# EAGLE design weather_shield (EAGLE 6.4)
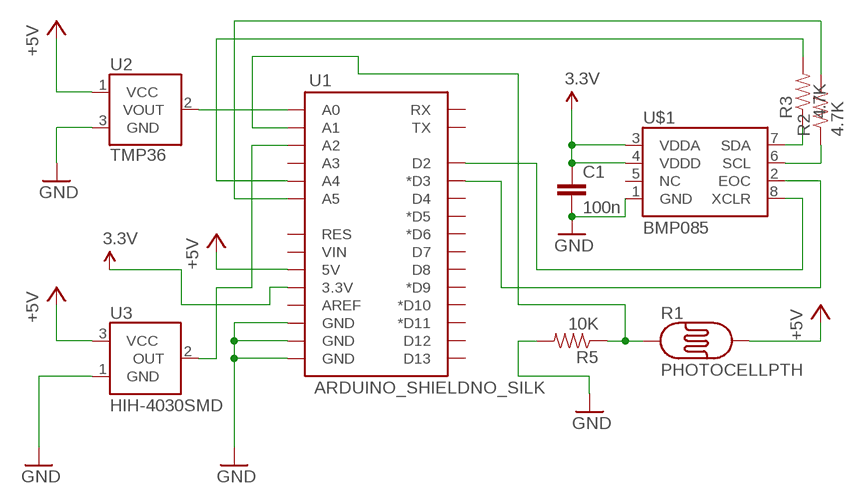
[diagram p0: schematic, sheet 1]

## Parts
C1  100n  CAP1206  [1206]
R1  PHOTOCELLPTH  [PHOTOCELL]
R2  4.7K  RESISTOR1206  [1206]
R3  4.7K  RESISTOR1206  [1206]
R5  10K  RESISTOR1206  [1206]
U1  ARDUINO_SHIELDNO_SILK  [DUEMILANOVE_VIAS]
U2  TMP36  TMP36GT9  [TO-92]
U3  HIH-4030SMD  [HIH-4030]
U$1  BMP085  [BMP085]

## Nets
3.3V: C1.1 U1.3.3V U$1.3(VDDA) U$1.4(VDDD)
+5V: R1.2 U1.5V U2.1(VCC) U3.3(VCC)
GND: C1.2 R5.2 U1.GND@0(GND) U1.GND@1(GND) U1.GND@2(GND) U2.3(GND) U3.1(GND) U$1.1(GND)
N$1: R1.1 R5.1 U1.A1
N$2: U1.A2 U3.2(OUT)
N$3: U1.A0 U2.2(VOUT)
N$4: R3.1 U$1.7(SDA)
N$5: R2.1 U$1.6(SCL)
N$6: U1.D2 U$1.8(XCLR)
N$7: R3.2 U1.A4
N$8: R2.2 U1.A5
N$9: U1.D3(*D3) U$1.2(EOC)
Unconnected: U1.A3 U1.AREF U1.D4 U1.D5(*D5) U1.D6(*D6) U1.D7 U1.D8 U1.D9(*D9) U1.D10(*D10) U1.D11(*D11) U1.D12 U1.D13 U1.RES U1.RX U1.TX U1.VIN U$1.5(NC)

## Library data of the parts
C1 = SparkFun-Passives:CAP: Capacitor Standard 0603 ceramic capacitor, and 0.1" leaded capacitor.
R1 = SparkFun-Sensors:PHOTOCELL: CdS photoresistor. This is a low cost way to detect light levels. Resistance decreases with more incoming light. SparkFun SKU: SEN-09088
R2 R3 R5 = SparkFun-Passives:RESISTOR: Resistor Basic schematic elements and footprints for 0603, 1206, and PTH resistors.
U1 = SparkFun-Boards:ARDUINO_SHIELD: Arduino shield footprint
U2 = SparkFun-Sensors:TMP36: Precision degC temp sensor, analog out
U3 = SparkFun-Sensors:HIH-4030: Humidity Sensor
U$1 = SparkFun-Sensors:BMP085: BMP085 Pressure Sensor Great little MEMS pressure sensor. SKU: COM-09603

## Net classes
0 default: width 0.508 mm

## Board
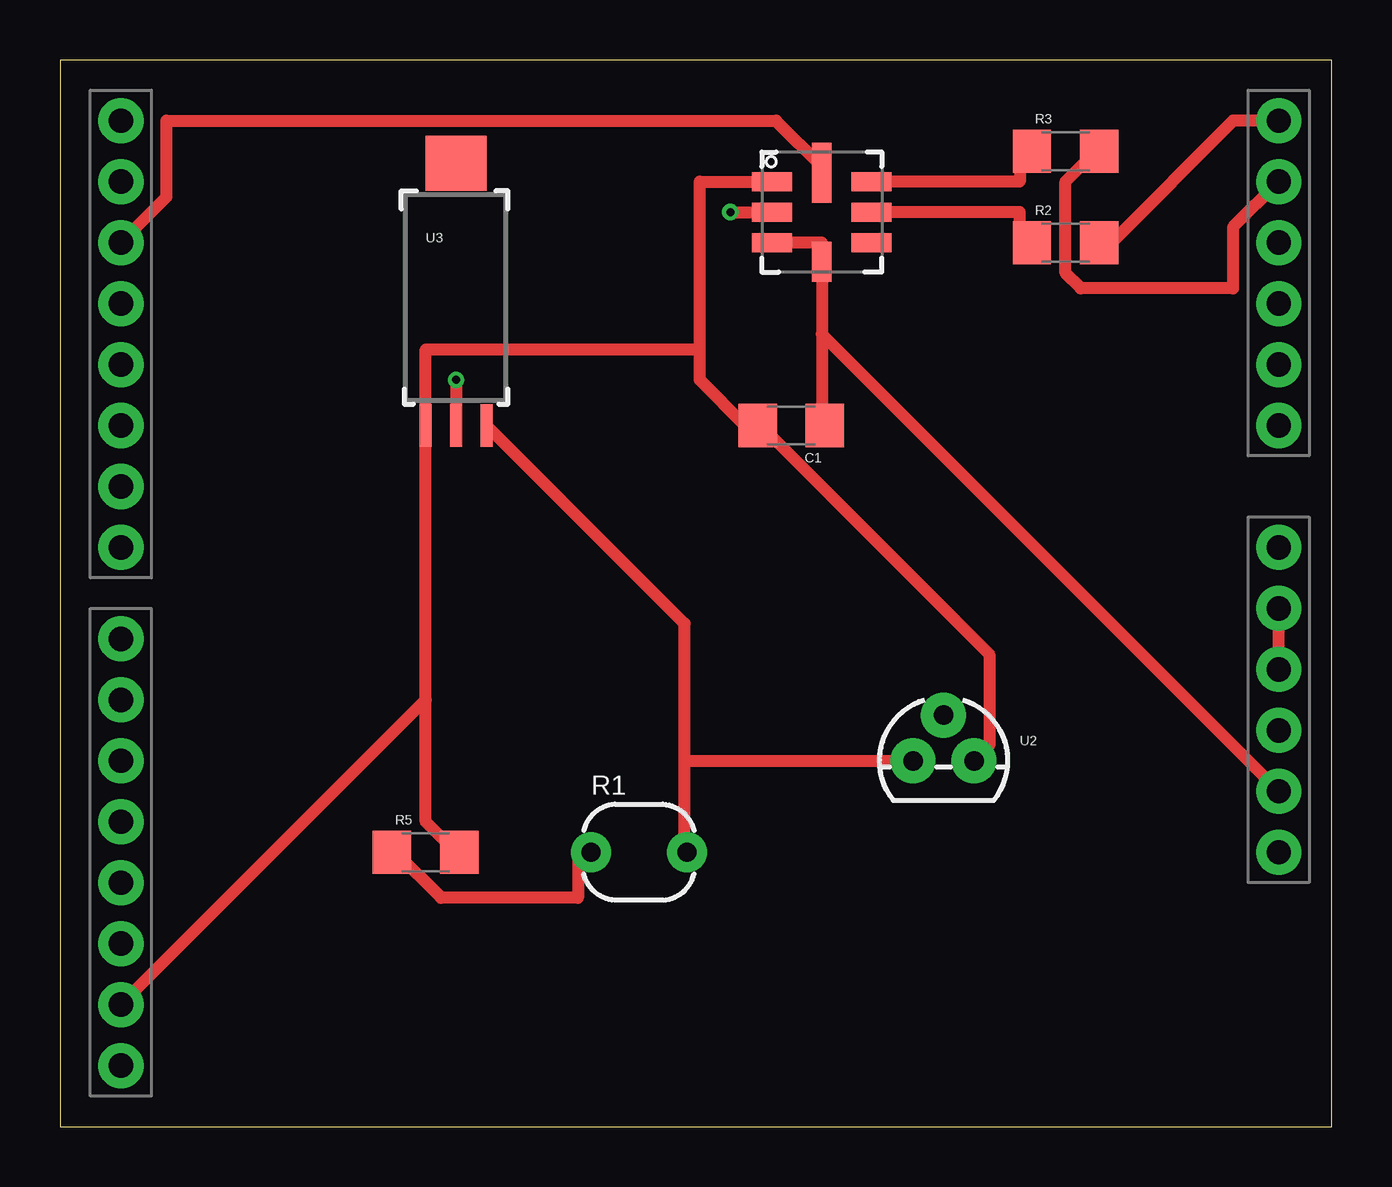
[diagram p1: board, top side]
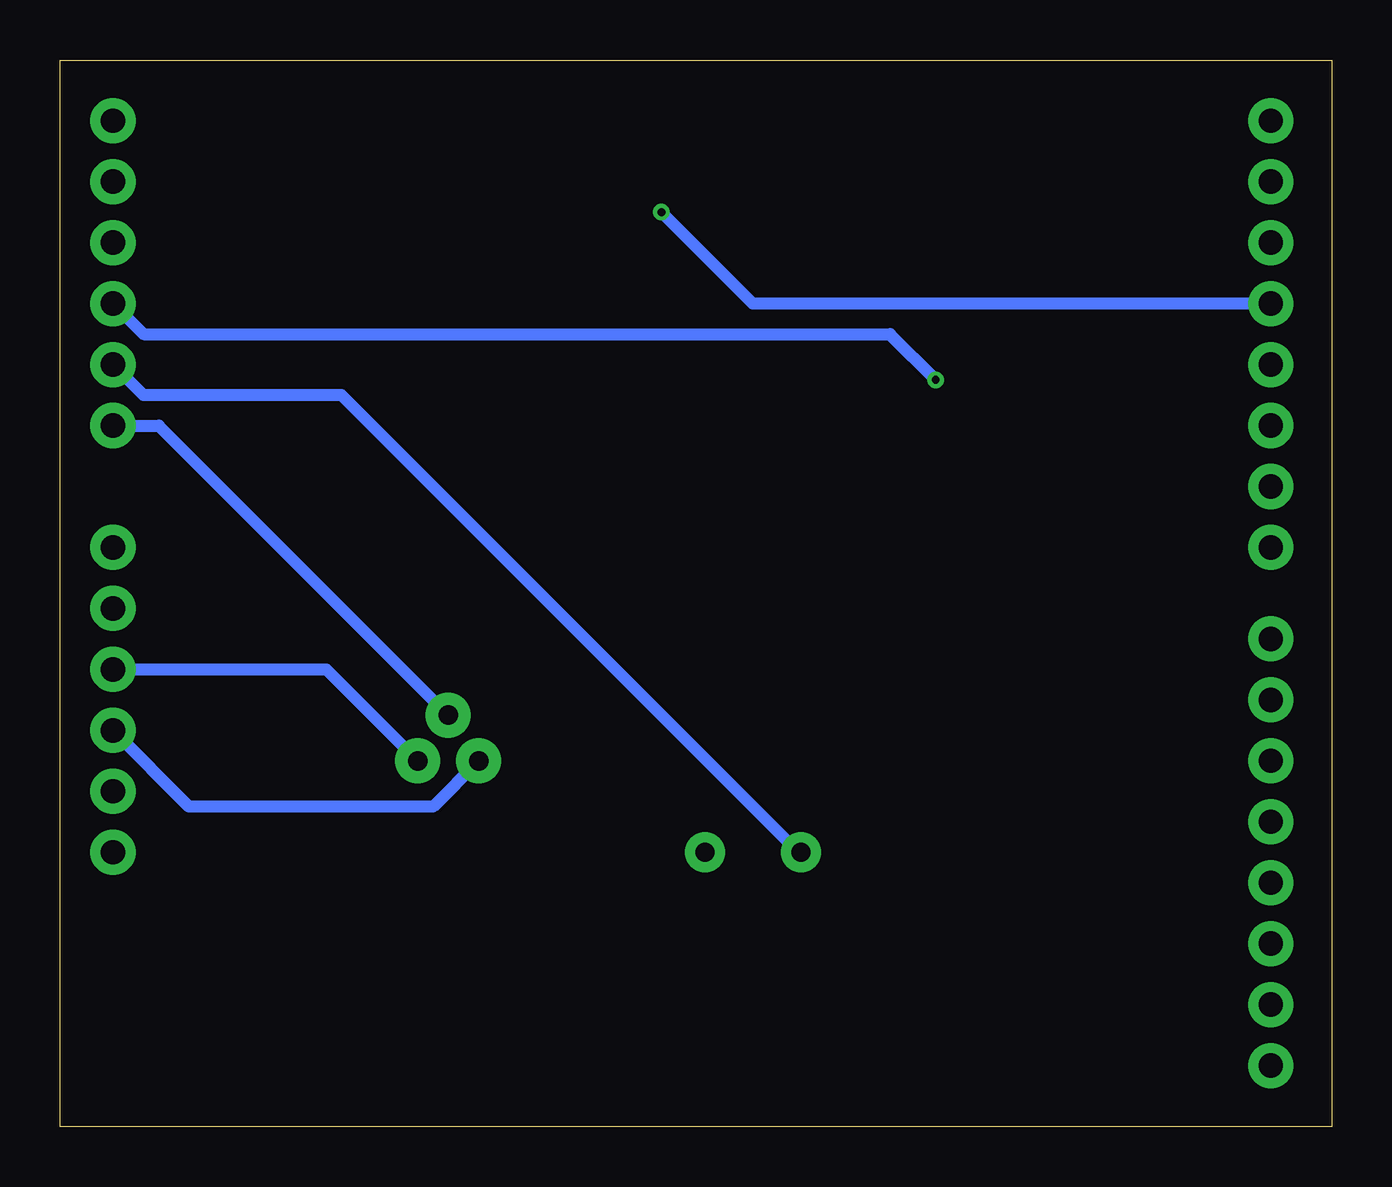
[diagram p2: board, bottom side, seen from below]

Size 53.01 x 44.44 mm. Coordinates in mm from the lower left corner, seen from the top.
Outline: 0,0 53.01,0 53.01,44.44 0,44.44 0,0
Copper layers (1*16): Top 0.0356mm / dielectric 1.5011mm / Bottom 0.0356mm
Design rules "LaenPCBOrder": minimum track width 6mil, minimum drill 13mil, track to track 6mil, track to pad 6mil, pad to pad 6mil, via to via 6mil, smd to smd 6mil, copper to edge 15mil, drill to drill 6mil, minimum pad ring 7mil, minimum via ring 7mil, stop-mask expansion 4mil, vias tented up to drill 0mil, thermal gap 10mil

### Footprints (pad centres in the part's own frame; a part is rotated, then mirrored left to right if it is on the bottom)
1206 = smd 1.6 x 1.8: 1 -1.4,0; 2 1.4,0
PHOTOCELL = drill 0.8 pad 1.676: 1 -2,0; 2 2,0
DUEMILANOVE_VIAS = drill 1.016 pad 1.88: 3.3V 50.8,13.97; 5V 50.8,16.51; A0 50.8,29.21; A1 50.8,31.75; A2 50.8,34.29; A3 50.8,36.83; A4 50.8,39.37; A5 50.8,41.91; AREF 2.54,2.54; D2 2.54,36.83; D3 2.54,34.29; D4 2.54,31.75; D5 2.54,29.21; D6 2.54,26.67; D7 2.54,24.13; D8 2.54,20.32; D9 2.54,17.78; D10 2.54,15.24; D11 2.54,12.7; D12 2.54,10.16; D13 2.54,7.62; GND@0 50.8,19.05; GND@1 50.8,21.59; GND@2 2.54,5.08; RES 50.8,11.43; RX 2.54,41.91; TX 2.54,39.37; VIN 50.8,24.13
TO-92 = drill 0.813 pad 1.88: 1 -1.27,0; 2 0,1.905; 3 1.27,0
HIH-4030 = smd 0.508 x 1.778: 1 -1.27,-5.08; 2 0,-5.08; 3 1.27,-5.08 | smd 2.54 x 2.286: NC 0,5.842
BMP085 = smd 1.67 x 0.8: 1 -2.065,1.27; 2 -2.065,0; 3 -2.065,-1.27; 5 2.065,-1.27; 6 2.065,0; 7 2.065,1.27 | smd 0.8 x 1.67: 4 0,-2.065 | smd 0.8 x 2.5: 8 0,1.65

### Placement (x,y rotation side)
C1  30.48,29.21 180 top
R1  24.13,11.43 0 top
R2  41.91,36.83 0 top
R3  41.91,40.64 0 top
R5  15.24,11.43 0 top
U1  0,0 0 top
U2  36.83,15.24 0 top
U3  16.51,34.29 0 top
U$1  31.75,38.1 0 top

### Tracks (layer width: path | path; a pad name or v marks a point on that pad's centre or on a via)
3.3V
  Top 0.508: U$1.3 31.75,36.83 U$1.4 31.75,33.02 | 31.75,33.02 31.75,29.21 C1.1 | 31.75,33.02 U1.3.3V
+5V
  Top 0.508: U3.3 26.04,20.95 26.04,15.24 | 26.04,15.24 26.04,11.43 R1.2 | 26.04,15.24 U2.1
  Bottom 0.508: U1.5V 47.62,13.33 37.47,13.33 U2.1
GND
  Top 0.508: U1.GND@0 U1.GND@1 | 29.84,39.37 U$1.1 26.67,39.37 26.67,32.38 | 26.67,32.38 26.67,31.12 28.57,29.21 C1.2 29.21,29.21 38.73,19.68 38.73,15.88 U2.3 | 15.24,17.78 15.24,12.7 16.51,11.43 R5.2 | 15.24,17.78 U3.1 15.24,32.38 26.67,32.38 | 15.24,17.78 U1.GND@2
  Bottom 0.508: U2.3 41.91,19.05 U1.GND@0
N$1
  Top 0.508: R5.1 13.97,11.43 15.88,9.52 21.59,9.52 21.59,11.43 R1.1
  Bottom 0.508: U1.A1 49.53,30.48 41.27,30.48 22.23,11.43 R1.1
N$2  (via drill 0.33)
  Top 0.508: v16.51,31.12 U3.2
  Bottom 0.508: v16.51,31.12 18.41,33.02 49.53,33.02 U1.A2
N$3
  Bottom 0.508: U2.2 48.9,29.21 U1.A0
N$4
  Top 0.508: U$1.7 40.01,39.37 40.01,40.64 R3.1
N$5
  Top 0.508: U$1.6 40.01,38.1 40.01,36.83 R2.1
N$6
  Top 0.508: U1.D2 4.45,38.73 4.45,41.91 29.84,41.91 31.75,40.01 U$1.8
N$7
  Top 0.508: U1.A4 48.9,37.46 48.9,34.92 42.55,34.92 41.91,35.56 41.91,39.37 43.18,40.64 R3.2
N$8
  Top 0.508: U1.A5 48.9,41.91 43.81,36.83 R2.2
N$9  (via drill 0.33)
  Top 0.508: v27.94,38.1 U$1.2
  Bottom 0.508: v27.94,38.1 24.13,34.29 U1.D3

### Text on the board
tDocu: Weather Shield / / Marc-Olivier Schwartz 2013